# Altium schematic sheet UKU100rs.SchDoc
size B
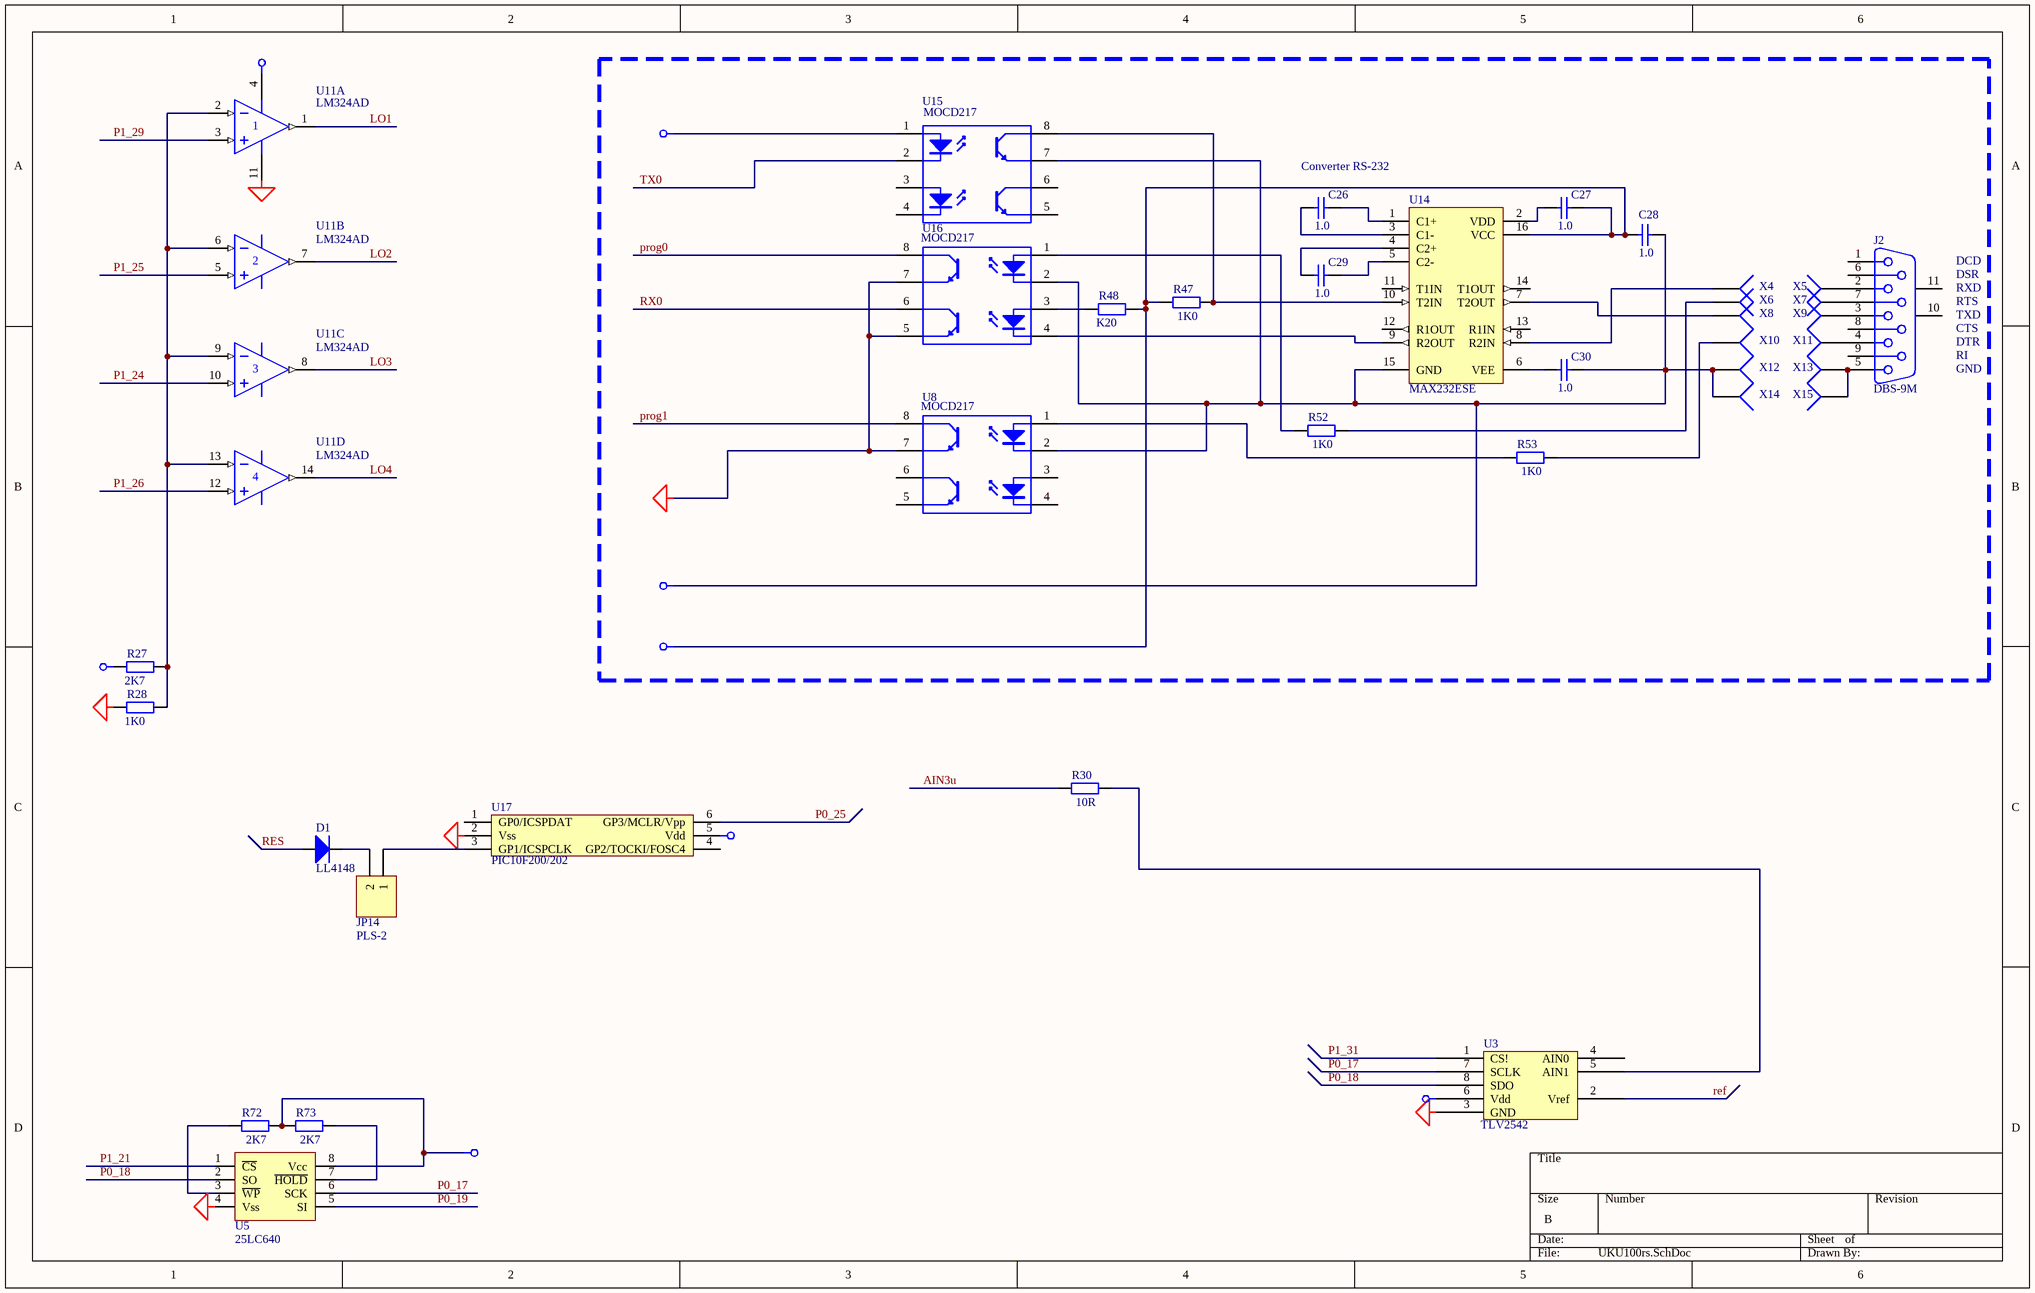
[diagram p0: UKU100rs.SchDoc]

## Parts
C26  1.0  [C3216-1206]
C27  1.0  [_1206]
C28  1.0  [C3216-1206]
C29  1.0  [C3216-1206]
C30  1.0  [C3216-1206]
D1  LL4148  [_1206D]
J2  DBS-9M  [DSUB_N9]
JP14  PLS-2  [HDR1X2]
R27  2K7  [_1206]
R28  1K0  [_1206]
R30  10R  [_1206]
R47  1K0  [_1206]
R48  K20  [_1206]
R52  1K0  [_1206]
R53  1K0  [_1206]
R72  2K7  [_1206]
R73  2K7  [_1206]
U3  TLV2542  [SO-G8]
U5  25LC640  [SO-G8/D5]
U8  MOCD217  [SO-G8]
U11  LM324AD  [SO-G14/G3.3]  (parts A,B,C,D of 4)
U14  MAX232ESE  [SO-G16]
U15  MOCD217  [SO-G8]
U16  MOCD217  [SO-G8]
U17  PIC10F200/202  [SOT23 - 6]
X4  (no value)  [PIN1]
X5  (no value)  [PIN1]
X6  (no value)  [PIN1]
X7  (no value)  [PIN1]
X8  (no value)  [PIN1]
X9  (no value)  [PIN1]
X10  (no value)  [PIN1]
X11  (no value)  [PIN1]
X12  (no value)  [PIN1]
X13  (no value)  [PIN1]
X14  (no value)  [PIN1]
X15  (no value)  [PIN1]

## Nets
+3v3: U17.5(Vdd)
+3v3_: U15.1(A)
+5v: R27.1 R72.2 R73.1 U3.6(Vdd) U5.8(Vcc) U11.4(V+)
+5v_iz: C27.2 C28.1 R47.1 R48.2 U14.16(VCC)
-5v_iz: C28.2 C30.2 U8.2(K) U14.15(GND) U15.7(E) U16.2(K) X12.1 X14.1
GND: R28.1 U3.3(GND) U5.4(Vss) U8.7(E) U11.11(V-) U16.5(E) U16.7(E) U17.2(Vss)
AIN3u: R30.1
LO1: U11.1(OUT)
LO2: U11.7(OUT)
LO3: U11.8(OUT)
LO4: U11.14(OUT)
P0_17: U3.7(SCLK) U5.6(SCK)
P0_18: U3.8(SDO) U5.2(SO)
P0_19: U5.5(SI)
P0_25: U17.6(GP3/MCLR/Vpp)
P1_21: U5.1(~{CS})
P1_24: U11.10(IN+)
P1_25: U11.5(IN+)
P1_26: U11.12(IN+)
P1_29: U11.3(IN+)
P1_31: U3.1(CS!)
prog0: U16.8(C)
prog1: U8.8(C)
ref: U3.2(Vref)
RES: D1.1(A)
RX0: U16.6(C)
TX0: U15.2(K)
NetC26_1: C26.1 U14.3(C1-)
NetC26_2: C26.2 U14.1(C1+)
NetC27_1: C27.1 U14.2(VDD)
NetC29_1: C29.1 U14.4(C2+)
NetC29_2: C29.2 U14.5(C2-)
NetC30_1: C30.1 U14.6(VEE)
NetD1_2: D1.2(K) JP14.2
NetJ2_2: J2.2 X5.1
NetJ2_3: J2.3 X9.1
NetJ2_4: J2.4 X11.1
NetJ2_5: J2.5 X13.1 X15.1
NetJ2_7: J2.7 X7.1
NetJP14_1: JP14.1 U17.3(GP1/ICSPCLK)
NetR27_2: R27.2 R28.2 U11.2(IN-) U11.6(IN-) U11.9(IN-) U11.13(IN-)
NetR30_2: R30.2 U3.5(AIN1)
NetR47_2: R47.2 U14.10(T2IN) U15.8(C)
NetR48_1: R48.1 U16.3(A)
NetR52_1: R52.1 U16.1(A)
NetR52_2: R52.2 X6.1
NetR53_1: R53.1 U8.1(A)
NetR53_2: R53.2 X10.1
NetR72_1: R72.1 U5.3(~{WP})
NetR73_2: R73.2 U5.7(~{HOLD})
NetU14_7: U14.7(T2OUT) X8.1
NetU14_8: U14.8(R2IN) X4.1
NetU14_9: U14.9(R2OUT) U16.4(K)

Not connected (* = marked no-connect by the designer): J2 1 6 8 9 10(MH1) 11(MH2); U3 4(AIN0); U8 3(A) 4(K) 5(E) 6(C); U14 11(T1IN) 12(R1OUT) 13(R1IN) 14(T1OUT); U15 3(A) 4(K) 5(E) 6(C); U17 1(GP0/ICSPDAT) 4(GP2/TOCKI/FOSC4)

## Notes on the sheet
- Converter RS-232
- (near J2) DCD
- (near J2) DSR
- (near J2) RXD
- (near J2) RTS
- (near J2) TXD
- (near J2) CTS
- (near J2) DTR
- (near J2) RI
- (near J2) GND
- (in symbol LM324AD, part D) 4

## Library data of the parts
C26-C30 = Cap Semi: Capacitor (Semiconductor SIM Model); Manufacturer: Generic Components; Class I: Passive; Value: 1,0; Published: 8-Jun-2000; Revision: July-2002: Re-released for DXP Platform.; Publisher: Altium Limited; Class II: Capacitor
D1 = Diode: Default Diode; Manufacturer: Generic Components; Class I: Discrete; Class II: Diode - Switching; Published: 8-Jun-2000; Revision: July-2002: Re-released for DXP Platform.; Publisher: Altium Limited
J2 = D Connector 9: Receptacle Assembly, 9 Position, Right Angle; Manufacturer: Generic Components; Package Information: Latest Revision: O; Positions: 9; Published: 15-Jun-2001; Revision: July-2002: Re-released for DXP Platform.; Datasheet: (1-Sep-1999); Package Reference: 788750; Publisher: Altium Limited; Class I: Connector; Orientation: Right Angle; Gender: Receptacle
JP14 = Header 2: Header, 2-Pin; Manufacturer: Generic Components; Class I: Connector; Revision: July-2002: Re-released for DXP Platform.; Publisher: Altium Limited
R27 R30 R47 R52 R53 R72 R73 = Res2: Resistor; Manufacturer: Generic Components; Class I: Passive; Rule: Undefined; Published: 8-Jun-2000; Revision: July-2002: Re-released for DXP Platform.; Publisher: Altium Limited; Class II: Resistor
  R27 R72 R73: Value: 2K7
  R30: Value: 10R
  R47 R52 R53: Value: 1K0
R28 = Res2: Resistor; Manufacturer: Generic Components; Class I: Passive; Value: 2K7; Rule: Undefined; Published: 8-Jun-2000; Revision: July-2002: Re-released for DXP Platform.; Publisher: Altium Limited; Class II: Resistor
R48 = Res2: Resistor; Manufacturer: Generic Components; Class I: Passive; Value: 200R; Rule: Undefined; Published: 8-Jun-2000; Revision: July-2002: Re-released for DXP Platform.; Publisher: Altium Limited; Class II: Resistor
U11 = LM324AD: Quadruple Operational Amplifier; Manufacturer: Texas Instruments; Package Information: Latest Revision: Jan-1998; Published: 15-Apr-2002; Revision: 23-Sep-2002: PCB footprint, 'SO-G8/E2.5' replaced.; Datasheet: Linear Circuits Data Book 1989 Volume 1 (Jan-1989); Package Reference: D014; Publisher: Altium Limited; Class I: Amplifier; Class II: Operational Amplifier
U14 = MAX232ESE: +5V Powered, Multi-Channel RS-232 Driver/Receiver; Manufacturer: Maxim; Class I: Communication; Class II: Transceiver; Published: 16-Jan-2001; Revision: July-2002: Re-released for DXP Platform.; Package Reference: NSO16; Publisher: Altium Limited
X4-X15 = Socket: Manufacturer: Generic Components; Class I: Connector; Revision: July-2002: Re-released for DXP Platform.; Publisher: Altium Limited